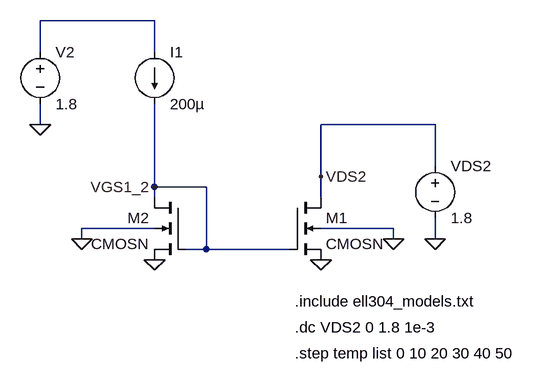
[diagram p0: schematic exmp6.asc]
exmp6.asc, the LTspice schematic file:
Version 4
SHEET 1 880 680
WIRE 16 -128 -160 -128
WIRE -160 -80 -160 -128
WIRE 16 -80 16 -128
WIRE -160 32 -160 0
WIRE 448 32 272 32
WIRE 448 96 448 32
WIRE 272 112 272 32
WIRE 16 128 16 0
WIRE 96 128 16 128
WIRE 16 144 16 128
WIRE 272 144 272 112
WIRE 16 192 -96 192
WIRE 384 192 272 192
WIRE -96 208 -96 192
WIRE 384 208 384 192
WIRE 448 208 448 176
WIRE 96 224 96 128
WIRE 96 224 64 224
WIRE 224 224 96 224
FLAG 384 208 0
FLAG 272 240 0
FLAG 448 208 0
FLAG -96 208 0
FLAG 16 240 0
FLAG -160 32 0
FLAG 16 128 VGS1_2
FLAG 272 112 VDS2
SYMBOL nmos4 224 144 R0
SYMATTR InstName M1
SYMATTR Value CMOSN
SYMATTR Value2 l=0.18u w=5u
SYMBOL nmos4 64 144 M0
SYMATTR InstName M2
SYMATTR Value CMOSN
SYMATTR Value2 l=0.18u w=5u
SYMBOL voltage 448 80 R0
WINDOW 123 0 0 Left 0
WINDOW 39 0 0 Left 0
SYMATTR InstName VDS2
SYMATTR Value 1.8
SYMBOL current 16 -80 R0
SYMATTR InstName I1
SYMATTR Value 200µ
SYMBOL voltage -160 -96 R0
SYMATTR InstName V2
SYMATTR Value 1.8
TEXT 232 304 Left 2 !.include ell304_models.txt
TEXT 232 344 Left 2 !.dc VDS2 0 1.8 1e-3
TEXT 232 384 Left 2 !.step temp list 0 10 20 30 40 50

The netlist it stands for:
* exmp6.asc
M1 VDS2 VGS1_2 0 0 CMOSN l=0.18u w=5u
M2 VGS1_2 VGS1_2 0 0 CMOSN l=0.18u w=5u
VDS2 VDS2 0 1.8
I1 N001 VGS1_2 200µ
V2 N001 0 1.8
.model NMOS NMOS
.model PMOS PMOS
.lib standard.mos
.include ell304_models.txt
.dc VDS2 0 1.8 1e-3
.step temp list 0 10 20 30 40 50
.backanno
.end